# EAGLE design OutragianNanoPM (EAGLE 7.2.0)
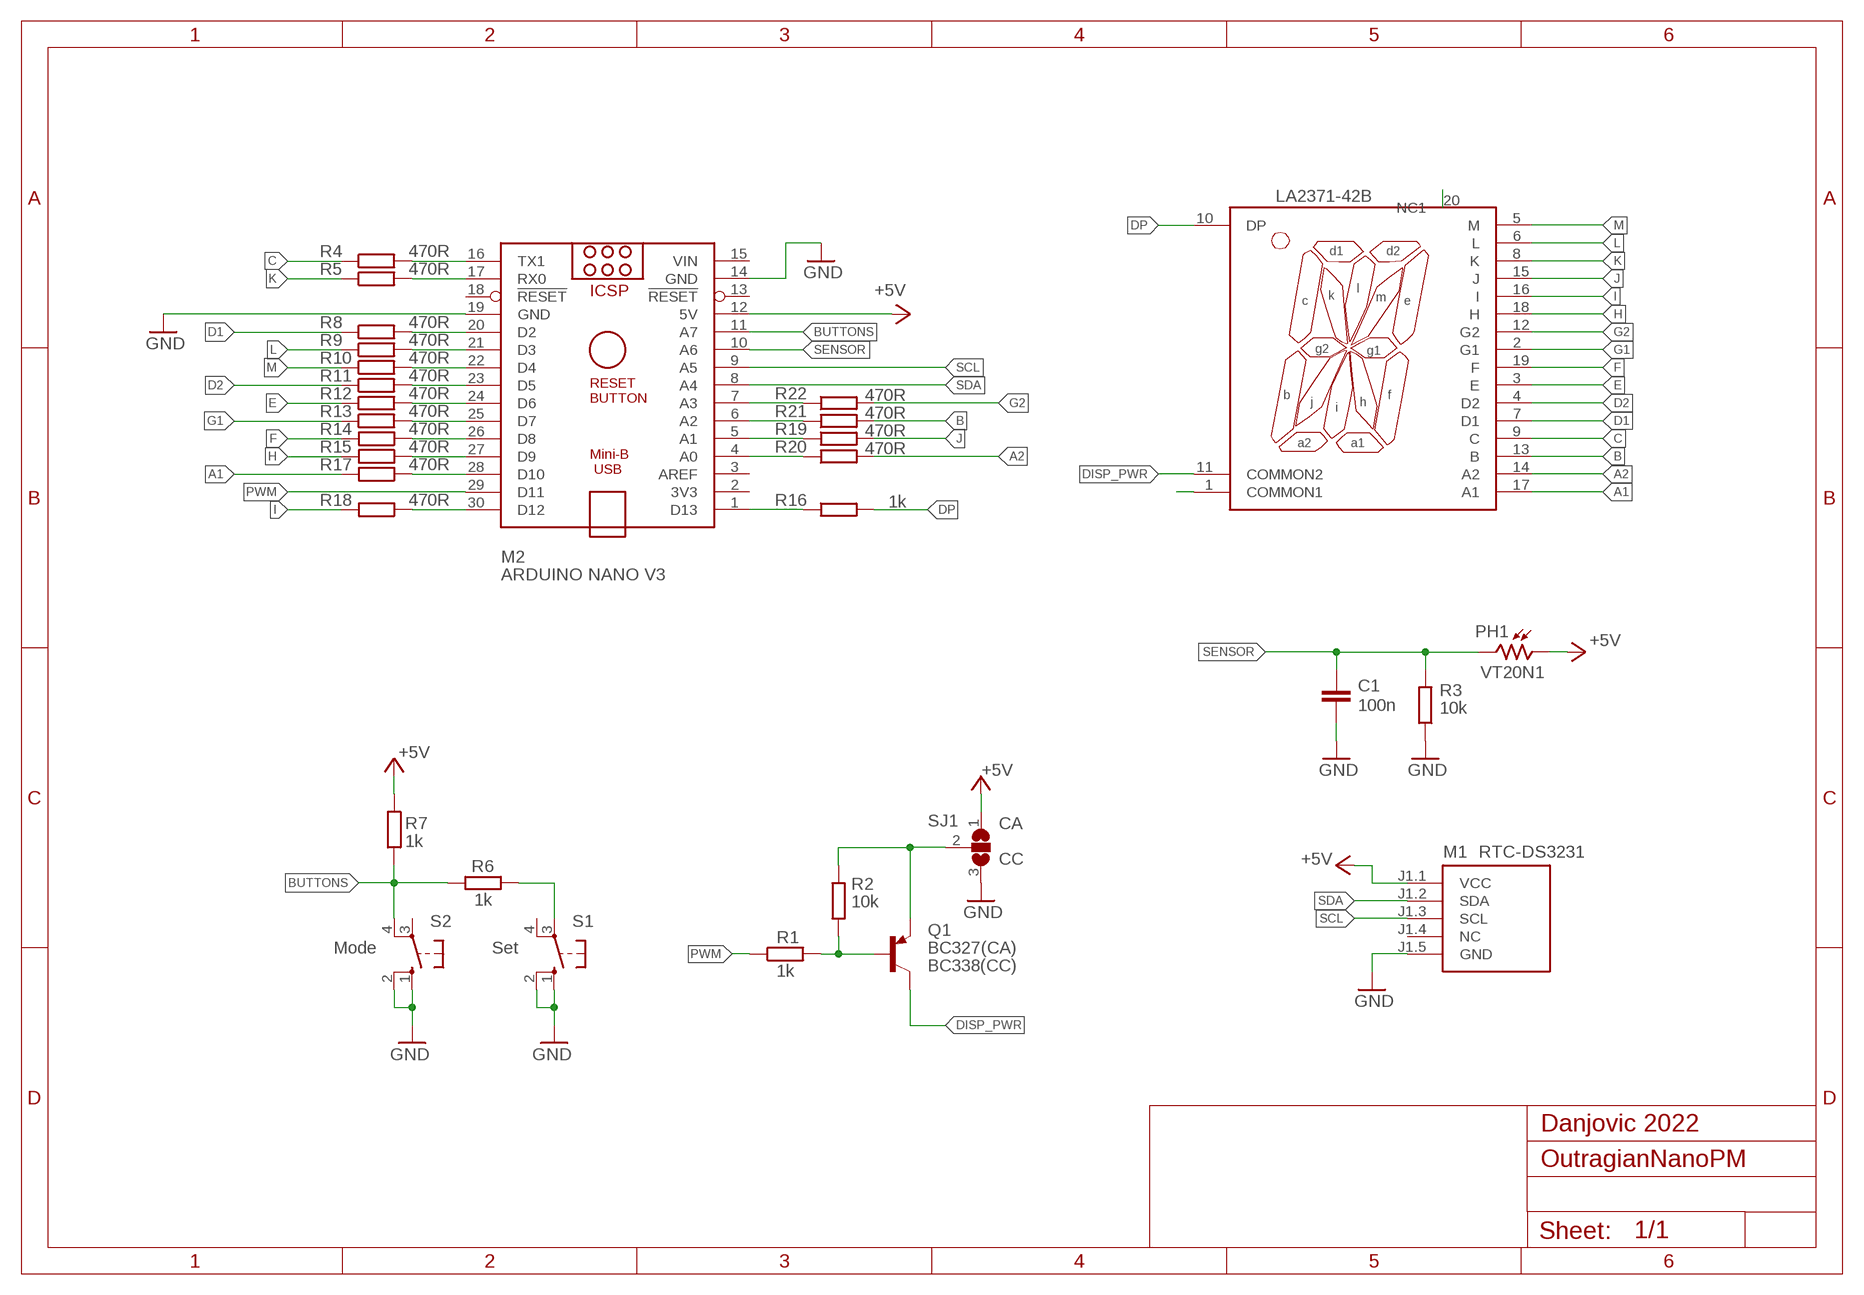
[diagram p0: schematic, sheet 1]

## Parts
C1  100n  C-EUC050-024X044L  [C050-024X044L]
DS1  LA2371-42B  LA(C)2371-42B-M1""  [LA(C)2371-42B-M1]
M1  RTC-DS3231  [RTC-DS3231_SMALL]
M2  ARDUINO NANO V3  ARDUINO_NANO  [ARDUINO_NANO]
PH1  VT20N1  [TO46-VT200]
Q1  BC327  [TO92-EBC]
R1  1k  R-EU_0204/7L  [0204/7L]
R2  10k  R-EU_0204/7L  [0204/7L]
R3  10k  R-EU_0204/7L  [0204/7L]
R4  470R  R-EU_0204/7L  [0204/7L]
R5  470R  R-EU_0204/7L  [0204/7L]
R6  1k  R-EU_0204/7L  [0204/7L]
R7  1k  R-EU_0204/7L  [0204/7L]
R8  470R  R-EU_0204/7L  [0204/7L]
R9  470R  R-EU_0204/7L  [0204/7L]
R10  470R  R-EU_0204/7L  [0204/7L]
R11  470R  R-EU_0204/7L  [0204/7L]
R12  470R  R-EU_0204/7L  [0204/7L]
R13  470R  R-EU_0204/7L  [0204/7L]
R14  470R  R-EU_0204/7L  [0204/7L]
R15  470R  R-EU_0204/7L  [0204/7L]
R16  1k  R-EU_0204/7L  [0204/7L]
R17  470R  R-EU_0204/7L  [0204/7L]
R18  470R  R-EU_0204/7L  [0204/7L]
R19  470R  R-EU_0204/7L  [0204/7L]
R20  470R  R-EU_0204/7L  [0204/7L]
R21  470R  R-EU_0204/7L  [0204/7L]
R22  470R  R-EU_0204/7L  [0204/7L]
S1  10-XX  [B3F-10XX]
S2  10-XX  [B3F-10XX]
SJ1  SJ2W  [SJ_2]

## Nets
+5V: M1.J1.1(VCC) M2.12(5V) PH1.1 R7.1 SJ1.1
A1: DS1.17(A1) R17.2
A2: DS1.14(A2) R20.2
B: DS1.13(B) R21.2
BUTTONS: M2.11(A7) R6.2 R7.2 S2.4(P1)
C: DS1.9(C) R4.1
D1: DS1.7(D1) R8.1
D2: DS1.4(D2) R11.1
DDP: M2.1(D13) R16.1
DISP_PWR: DS1.11(COMMON2) Q1.C
DISP_PWR2: DS1.1(COMMON1)
DP: DS1.10(DP) DS1.20(NC1) R16.2
E: DS1.3(E) R12.1
F: DS1.19(F) R14.2
G1: DS1.2(G1) R13.1
G2: DS1.12(G2) R22.2
GND: C1.2 M1.J1.5(GND) M2.14(GND) M2.19(GND) R3.1 S1.1(S) S1.2(S1) S2.1(S) S2.2(S1) SJ1.3
H: DS1.18(H) R15.2
I: DS1.16(I) R18.2
J: DS1.15(J) R19.2
K: DS1.8(K) R5.1
L: DS1.6(L) R9.1
M: DS1.5(M) R10.1
N$1: Q1.B R1.2 R2.2
N$2: M2.7(A3) R22.1
N$3: R6.1 S1.3(P)
N$4: M2.26(D8) R14.1
N$5: M2.6(A2) R21.1
N$6: Q1.E R2.1 SJ1.2
N$7: M2.5(A1) R19.1
N$8: M2.4(A0) R20.1
N$21: M2.27(D9) R15.1
N$22: M2.28(D10) R17.1
N$23: M2.30(D12) R18.1
N$36: M2.25(D7) R13.2
N$37: M2.24(D6) R12.2
N$38: M2.23(D5) R11.2
N$39: M2.22(D4) R10.2
N$40: M2.21(D3) R9.2
N$41: M2.20(D2) R8.2
N$42: M2.17(RX0) R5.2
N$43: M2.16(TX1) R4.2
PWM: M2.29(D11) R1.1
SCL: M1.J1.3(SCL) M2.9(A5)
SDA: M1.J1.2(SDA) M2.8(A4)
SENSOR: C1.1 M2.10(A6) PH1.2 R3.2
Unconnected: M1.J1.4(NC) M2.2(3V3) M2.3(AREF) M2.13(!RESET) M2.18(!RESET) S1.4(P1) S2.3(P)

## Notes on the sheet
- LA2371-42B
- CA
- CC
- Mode | Set | (CA)
- BC338(CC)
- Danjovic 2022

## Power pins joined to a net without a drawn wire
VIN: M2.15(VIN)

## Library data of the parts
C1 = rcl:C-EU: CAPACITOR, European symbol
DS1 = la2371-42b:LA(C)2371-42B-M1: PART NO. : LA(C)2371-42B-M1 EWRN 2.3"(56.8mm)SINGLE DIGIT DISPLAY http://www.ledtech.com.tw
M1 = RTC:RTC-DS3231
M2 = ArduinoNanoV30:ARDUINO_NANO: Arduino Nano V3.0 Overview: The Arduino Nano is a small, complete, and breadboard-friendly board based on the ATmega328 (Arduino Nano 3.x) or ATmega168 (Arduino Nano 2.x). It has more or less the same functionality of the Arduino Duemilanove, but in a different package. It lacks only a DC power jack, and works with a Mini-B USB cable instead of a standard one. The Nano was designed and is being produced by Gravitech. Specifications: Microcontroller Atmel ATmega168 or ATmega328 Operating Voltage (logic level) 5 V Input Voltage (recommended) 7-12 V Input Voltage (limits) 6-20 V Digital I/O Pins 14 (of which 6 provide PWM output) Analog Input Pins 8 DC Current per I/O Pin 40 mA Flash Memory 16 KB (ATmega168) or 32 KB (ATmega328) of which 2 KB used by bootloader SRAM 1 KB (ATmega168) or 2 KB (ATmega328) EEPROM 512 bytes (ATmega168) or 1 KB (ATmega328) Clock Speed 16 MHz Dimensions 0.73" x 1.70" Length 45 mm Width 18 mm Weigth 5 g Power: The Arduino Nano can be powered via the Mini-B USB connection, 6-20V unregulated external power supply (pin 30), or 5V regulated external power supply (pin 27). The power source is automatically selected to the highest voltage source. Memory: The ATmega168 has 16 KB of flash memory for storing code (of which 2 KB is used for the bootloader); the ATmega328 has 32 KB, (also with 2 KB used for the bootloader). The ATmega168 has 1 KB of SRAM and 512 bytes of EEPROM (which can be read and written with the EEPROM library); the ATmega328 has 2 KB of SRAM and 1 KB of EEPROM. Input and Output: Each of the 14 digital pins on the Nano can be used as an input or output, using pinMode(), digitalWrite(), and digitalRead() functions. They operate at 5 volts. Each pin can provide or receive a maximum of 40 mA and has an internal pull-up resistor (disconnected by default) of 20-50 kOhms. In addition, some pins have specialized functions. Visit Arduino - ArduinoBoardNano <https://www.arduino.cc/en/Main/ArduinoBoardNano>
PH1 = photo-elements:VT2*: Photoconductive Cell VT200 Series Source: http://optoelectronics.perkinelmer.com/content/Datasheets/DTS_vt200seriesdatasheet.pdf
Q1 = transistor-pnp:BC327*: PNP Transistror
R1-R22 = rcl:R-EU_: RESISTOR, European symbol
S1 S2 = switch-omron:10-XX: OMRON SWITCH; MPN: B3F-1000; OC_FARNELL: 176432; OC_NEWARK: 36M3542
SJ1 = jumper:SJ2W: SMD solder JUMPER

## Board
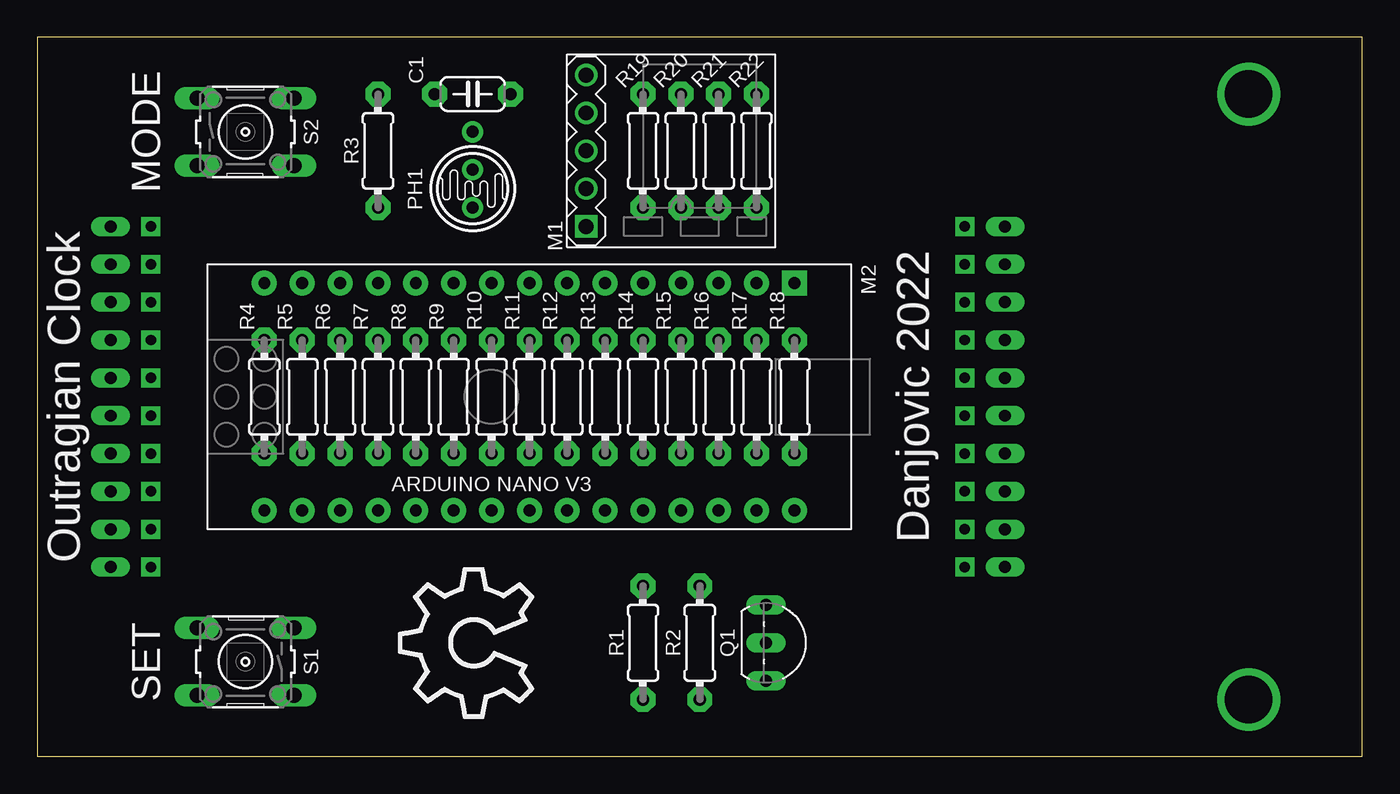
[diagram p1: board, top side]
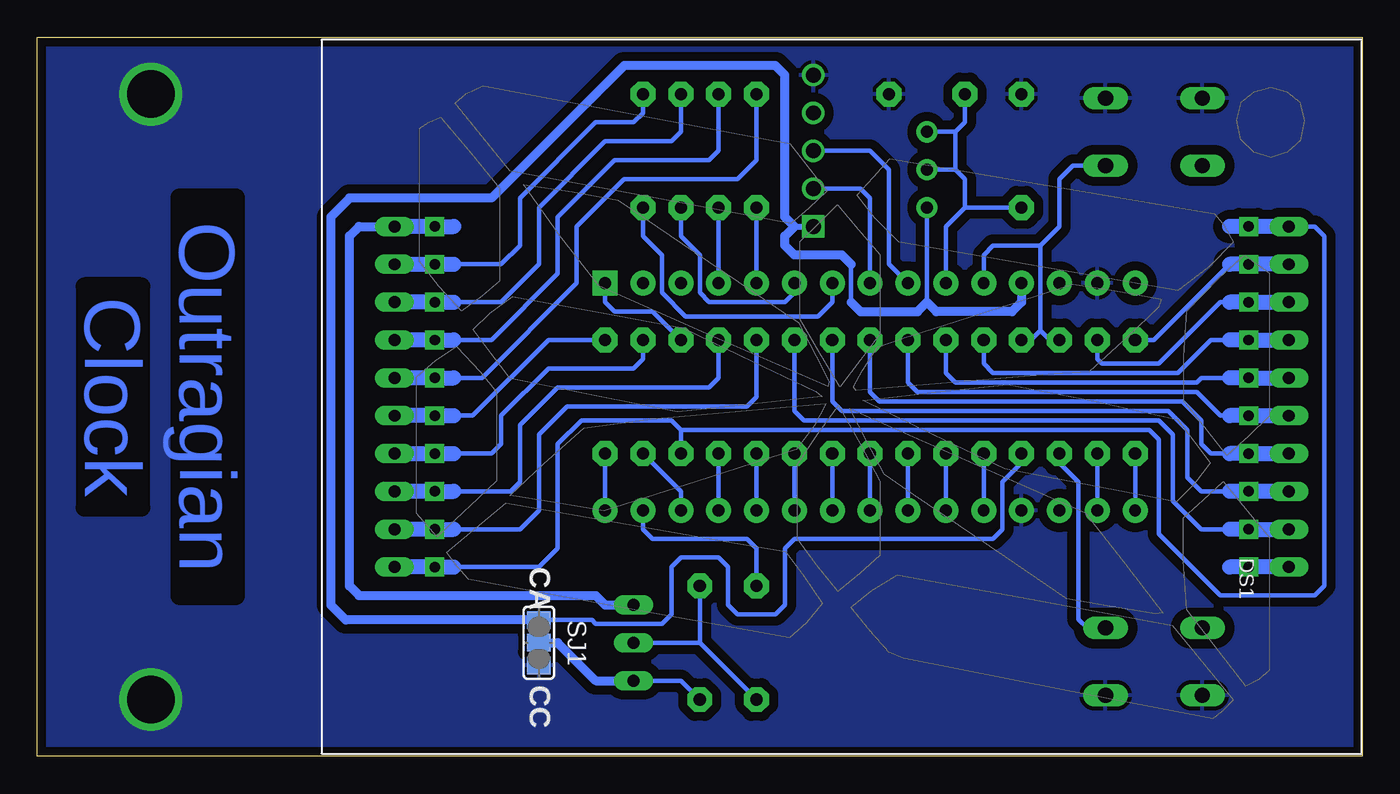
[diagram p2: board, bottom side, seen from below]

Size 88.9 x 48.26 mm. Coordinates in mm from the lower left corner, seen from the top.
Outline: 88.9,0 88.9,48.26 0,48.26 0,0 88.9,0
Copper layers (1*16): Top 0.035mm / dielectric 1.5mm / Bottom 0.035mm
Design rules "default *": minimum track width 10mil, minimum drill 24mil, track to track 8mil, track to pad 8mil, pad to pad 8mil, via to via 8mil, smd to smd 8mil, copper to edge 20mil, drill to drill 8mil, minimum pad ring 10mil, minimum via ring 8mil, stop-mask expansion 4mil, vias tented up to drill 0mil, thermal gap 10mil

### Footprints (pad centres in the part's own frame; a part is rotated, then mirrored left to right if it is on the bottom)
C050-024X044L = drill 0.813 pad 1.676 octagon: 1 -2.54,0; 2 2.54,0
LA(C)2371-42B-M1 = drill 0.8 long: 1 -11.43,-30; 2 -8.89,-30; 3 -6.35,-30; 4 -3.81,-30; 5 -1.27,-30; 6 1.27,-30; 7 3.81,-30; 8 6.35,-30; 9 8.89,-30; 10 11.43,-30; 11 11.43,30; 12 8.89,30; 13 6.35,30; 14 3.81,30; 15 1.27,30; 16 -1.27,30; 17 -3.81,30; 18 -6.35,30; 19 -8.89,30; 20 -11.43,30
RTC-DS3231_SMALL = drill 1 square: J1.1 -5.08,6.35 | drill 1: J1.2 -2.54,6.35; J1.3 0,6.35; J1.4 2.54,6.35; J1.5 5.08,6.35
ARDUINO_NANO = drill 0.8 pad 1.676 square: 1 -20.32,-7.62 | drill 0.8 pad 1.676: 2 -17.78,-7.62; 3 -15.24,-7.62; 4 -12.7,-7.62; 5 -10.16,-7.62; 6 -7.62,-7.62; 7 -5.08,-7.62; 8 -2.54,-7.62; 9 0,-7.62; 10 2.54,-7.62; 11 5.08,-7.62; 12 7.62,-7.62; 13 10.16,-7.62; 14 12.7,-7.62; 15 15.24,-7.62; 16 15.24,7.62; 17 12.7,7.62; 18 10.16,7.62; 19 7.62,7.62; 20 5.08,7.62; 21 2.54,7.62; 22 0,7.62; 23 -2.54,7.62; 24 -5.08,7.62; 25 -7.62,7.62; 26 -10.16,7.62; 27 -12.7,7.62; 28 -15.24,7.62; 29 -17.78,7.62; 30 -20.32,7.62
TO46-VT200 = drill 0.8 pad 1.4: 1 -1.27,0; 2 1.27,0
TO92-EBC = drill 0.813 long: B 0,-1.27; C -2.54,-1.27; E 2.54,-1.27
0204/7L = drill 0.813 pad 1.676 octagon: 1 -3.81,0; 2 3.81,0
B3F-10XX = drill 1.016 long: 1 -3.251,2.261; 2 3.251,2.261; 3 -3.251,-2.261; 4 3.251,-2.261
SJ_2 = smd 1.168 x 1.6: 1 -1.524,0; 2 0,0; 3 1.524,0

### Placement (x,y rotation side)
C1  29.21,44.45 0 top
DS1  34.92,24.13 90 bottom
M1  43.18,40.64 90 top
M2  30.48,24.13 180 top
PH1  29.21,38.1 90 top
Q1  50.16,7.62 270 top
R1  40.64,7.62 270 top
R2  44.45,7.62 90 top
R3  22.86,40.64 270 top
R4  15.24,24.13 270 top
R5  17.78,24.13 270 top
R6  20.32,24.13 90 top
R7  22.86,24.13 90 top
R8  25.4,24.13 270 top
R9  27.94,24.13 270 top
R10  30.48,24.13 270 top
R11  33.02,24.13 270 top
R12  35.56,24.13 270 top
R13  38.1,24.13 270 top
R14  40.64,24.13 90 top
R15  43.18,24.13 90 top
R16  45.72,24.13 270 top
R17  48.26,24.13 90 top
R18  50.8,24.13 90 top
R19  40.64,40.64 90 top
R20  43.18,40.64 90 top
R21  45.72,40.64 90 top
R22  48.26,40.64 90 top
S1  13.97,6.35 180 top
S2  13.97,41.91 0 top
SJ1  55.24,7.62 270 bottom

### Tracks (layer width: path | path; a pad name or v marks a point on that pad's centre or on a via)
+5V
  Bottom 0.305: 34.29,33.02 34.29,30.48 | R7.1 22.86,19.68 24.13,18.41 24.13,15.24 24.77,14.61 38.1,14.61 38.73,13.97 38.73,10.16 39.37,9.53 41.91,9.53 42.55,10.16 42.55,12.7 43.18,13.34 45.72,13.34 46.35,12.7 46.35,9.53 46.99,8.89 51.44,8.89 51.69,9.14 SJ1.1 | PH1.1 29.21,30.48
  Bottom 0.406: 38.1,35.56 M1.J1.1
  Bottom 0.61: 34.29,30.48 33.66,29.84 29.84,29.84 29.21,30.48 28.57,29.84 23.5,29.84 22.86,30.48 M2.12 | SJ1.1 68.2,9.14 69.22,10.16 69.22,36.2 67.94,37.47 58.42,37.47 49.53,46.35 39.37,46.35 38.73,45.72 38.73,36.2 38.1,35.56 38.73,34.92 38.73,34.29 38.1,33.66 34.92,33.66 34.29,33.02
A1  (via drill 0.7 pad 1.27)
  Bottom 0.305: 60.96,20.32 58.42,20.32 57.78,20.95 57.78,22.86 54.61,26.04 48.9,26.04 48.26,26.67 R17.2
  Bottom 1.016: DS1.17 v62.23,20.32 60.96,20.32
A2  (via drill 0.7 pad 1.27)
  Bottom 0.305: R20.2 43.18,40.64 43.81,40.01 50.16,40.01 53.98,36.2 53.98,32.38 58.42,27.94 60.96,27.94
  Bottom 1.016: DS1.14 v62.23,27.94 60.96,27.94
B  (via drill 0.7 pad 1.27)
  Bottom 0.305: R21.2 45.72,41.91 46.35,41.27 50.8,41.27 55.24,36.83 55.24,33.02 57.78,30.48 60.96,30.48
  Bottom 1.016: DS1.13 v62.23,30.48 60.96,30.48
BUTTONS
  Bottom 0.305: 21.59,34.29 24.77,34.29 25.4,33.66 M2.11 | 21.59,34.29 20.32,35.56 20.32,38.73 19.41,39.65 S2.4 | R7.2 22.23,27.94 21.59,28.57 | 21.59,28.57 21.59,34.29 | R6.2 20.95,27.94 21.59,28.57
C  (via drill 0.7 pad 1.27)
  Bottom 0.305: 8.89,33.02 13.97,27.94 R4.1
  Bottom 1.016: DS1.9 v7.62,33.02 8.89,33.02
D1  (via drill 0.7 pad 1.27)
  Bottom 0.305: R8.1 25.4,26.35 24.77,25.72 12.38,25.72 10.16,27.94 8.89,27.94
  Bottom 1.016: DS1.7 v7.62,27.94 8.89,27.94
D2  (via drill 0.7 pad 1.27)
  Bottom 0.305: R11.1 33.02,24.45 32.38,23.81 12.06,23.81 10.79,22.54 10.79,20.95 10.16,20.32 8.89,20.32
  Bottom 1.016: DS1.4 v7.62,20.32 8.89,20.32
DDP
  Bottom 0.305: R16.1 47.62,29.84 50.16,29.84 50.8,30.48 M2.1
DISP_PWR  (via drill 0.7 pad 1.27)
  Bottom 0.61: Q1.C 50.8,10.16 51.44,10.79 67.31,10.79 67.94,11.43 67.94,34.92 67.31,35.56 DS1.11
  Bottom 1.016: DS1.11 v62.23,35.56 60.96,35.56
DISP_PWR2  (via drill 0.7 pad 1.27)
  Bottom 1.016: DS1.1 v7.62,12.7 8.89,12.7
DP  (via drill 0.7 pad 1.27)
  Bottom 0.305: R16.2 45.72,21.91 | 45.72,21.91 14.29,21.91 13.65,21.27 13.65,14.92 9.53,10.79 3.17,10.79 2.54,11.43 2.54,34.92 3.17,35.56 DS1.10 | 45.72,21.91 46.35,22.54 52.39,22.54 53.98,20.95 53.98,13.97 55.24,12.7 60.96,12.7
  Bottom 1.016: DS1.20 v62.23,12.7 60.96,12.7 | DS1.10 v7.62,35.56 8.89,35.56
E  (via drill 0.7 pad 1.27)
  Bottom 0.305: R12.1 35.56,23.81 34.92,23.18 13.02,23.18 11.75,21.91 11.75,18.73 10.79,17.78 8.89,17.78
  Bottom 1.016: DS1.3 v7.62,17.78 8.89,17.78
F  (via drill 0.7 pad 1.27)
  Bottom 0.305: 60.96,15.24 56.52,15.24 55.24,16.51 55.24,21.59 53.34,23.5 41.27,23.5 40.64,24.13 R14.2
  Bottom 1.016: DS1.19 v62.23,15.24 60.96,15.24
G1  (via drill 0.7 pad 1.27)
  Bottom 0.305: R13.1 38.1,23.18 37.47,22.54 13.65,22.54 12.7,21.59 12.7,17.14 10.79,15.24 8.89,15.24
  Bottom 1.016: DS1.2 v7.62,15.24 8.89,15.24
G2  (via drill 0.7 pad 1.27)
  Bottom 0.305: 60.96,33.02 57.78,33.02 56.52,34.29 56.52,37.47 51.44,42.55 48.9,42.55 48.26,43.18 R22.2
  Bottom 1.016: DS1.12 v62.23,33.02 60.96,33.02
GND  (via drill 3.2)
  other vias: 81.28,44.45 81.28,3.81
  pour Bottom (isolate 0.61): 88.9,0 -0.32,0 -0.32,48.26 88.9,48.26
H  (via drill 0.7 pad 1.27)
  Bottom 0.305: 60.96,17.78 57.15,17.78 56.52,18.41 56.52,22.23 53.98,24.77 43.81,24.77 43.18,25.4 R15.2
  Bottom 1.016: DS1.18 v62.23,17.78 60.96,17.78
I  (via drill 0.7 pad 1.27)
  Bottom 0.305: 60.96,22.86 59.69,22.86 54.61,27.94 R18.2
  Bottom 1.016: DS1.16 v62.23,22.86 60.96,22.86
J  (via drill 0.7 pad 1.27)
  Bottom 0.305: R19.2 40.64,40.01 41.91,38.73 49.53,38.73 52.7,35.56 52.7,31.75 59.05,25.4 60.96,25.4
  Bottom 1.016: DS1.15 v62.23,25.4 60.96,25.4
K  (via drill 0.7 pad 1.27)
  Bottom 0.305: R5.1 17.78,26.67 17.46,26.35 13.65,26.35 9.53,30.48 8.89,30.48
  Bottom 1.016: DS1.8 v7.62,30.48 8.89,30.48
L  (via drill 0.7 pad 1.27)
  Bottom 0.305: R9.1 27.94,25.72 27.3,25.08 11.11,25.08 10.79,25.4 8.89,25.4
  Bottom 1.016: DS1.6 v7.62,25.4 8.89,25.4
M  (via drill 0.7 pad 1.27)
  Bottom 0.305: R10.1 30.48,25.08 29.84,24.45 11.11,24.45 9.53,22.86 8.89,22.86
  Bottom 1.016: DS1.5 v7.62,22.86 8.89,22.86
N$1
  Bottom 0.305: Q1.B 44.45,7.62 | 44.45,7.62 R2.2 | R1.2 44.45,7.62
N$2
  Bottom 0.305: M2.7 35.56,30.48 36.51,29.53 45.4,29.53 46.99,31.11 46.99,33.66 48.26,34.92 R22.1
N$3
  Bottom 0.305: R6.1 20.32,19.68 19.05,18.41 19.05,9.21 18.45,8.61 S1.3
N$4
  Bottom 0.305: R14.1 M2.26
N$5
  Bottom 0.305: M2.6 38.1,31.11 38.73,30.48 43.81,30.48 44.45,31.11 44.45,33.66 45.72,34.92 R21.1
N$6
  Bottom 0.305: Q1.E 45.72,5.08 R2.1
  Bottom 0.61: SJ1.2 53.98,7.62 51.44,5.08 Q1.E
N$7
  Bottom 0.305: M2.5 R19.1
N$8
  Bottom 0.305: M2.4 R20.1
N$21
  Bottom 0.305: R15.1 M2.27
N$22
  Bottom 0.305: M2.28 45.72,17.78 R17.1
N$23
  Bottom 0.305: R18.1 M2.30
N$36
  Bottom 0.305: R13.2 M2.25
N$37
  Bottom 0.305: R12.2 M2.24
N$38
  Bottom 0.305: R11.2 M2.23
N$39
  Bottom 0.305: R10.2 M2.22
N$40
  Bottom 0.305: R9.2 M2.21
N$41
  Bottom 0.305: R8.2 M2.20
N$42
  Bottom 0.305: R5.2 M2.17
N$43
  Bottom 0.305: M2.16 R4.2
PWM
  Bottom 0.305: R1.1 40.64,13.97 41.27,14.61 47.62,14.61 48.26,15.24 M2.29
SCL
  Bottom 0.305: M2.9 31.75,33.02 31.75,39.37 33.02,40.64 M1.J1.3
SDA
  Bottom 0.305: M2.8 33.02,37.47 33.66,38.1 M1.J1.2
SENSOR  (via drill 0.8 pad 1.42)
  Bottom 0.305: M2.10 27.94,35.56 26.67,36.83 | C1.1 26.67,42.55 27.3,41.91 | 26.67,36.83 26.67,38.73 27.3,39.37 | 26.67,36.83 R3.2 | PH1.2 27.3,39.37 | v29.21,41.91 27.3,41.91 | 27.3,39.37 27.3,41.91

### Text on the board
Bottom: Outragian | Clock
tPlace: MODE | Outragian Clock | Danjovic 2022 | SET
bPlace: CA | CC
bStop: Outragian | Clock